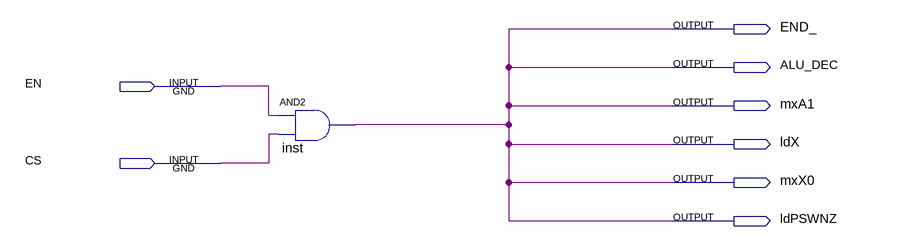
[diagram p0: schematic sheet]
// Quartus schematic DEX.bdf as structural Verilog: 1 symbols, 8 pins
module DEX (
  input  EN,
  input  CS,
  output END_,
  output ALU_DEC,
  output mxA1,
  output ldX,
  output mxX0,
  output ldPSWNZ
);

  and inst (ALU_DEC, EN, CS);

  assign END_ = ALU_DEC;
  assign ldPSWNZ = ALU_DEC;
  assign ldX = ALU_DEC;
  assign mxA1 = ALU_DEC;
  assign mxX0 = ALU_DEC;
endmodule
